# EAGLE design baby_monitor_v2 (EAGLE 9.6.2)
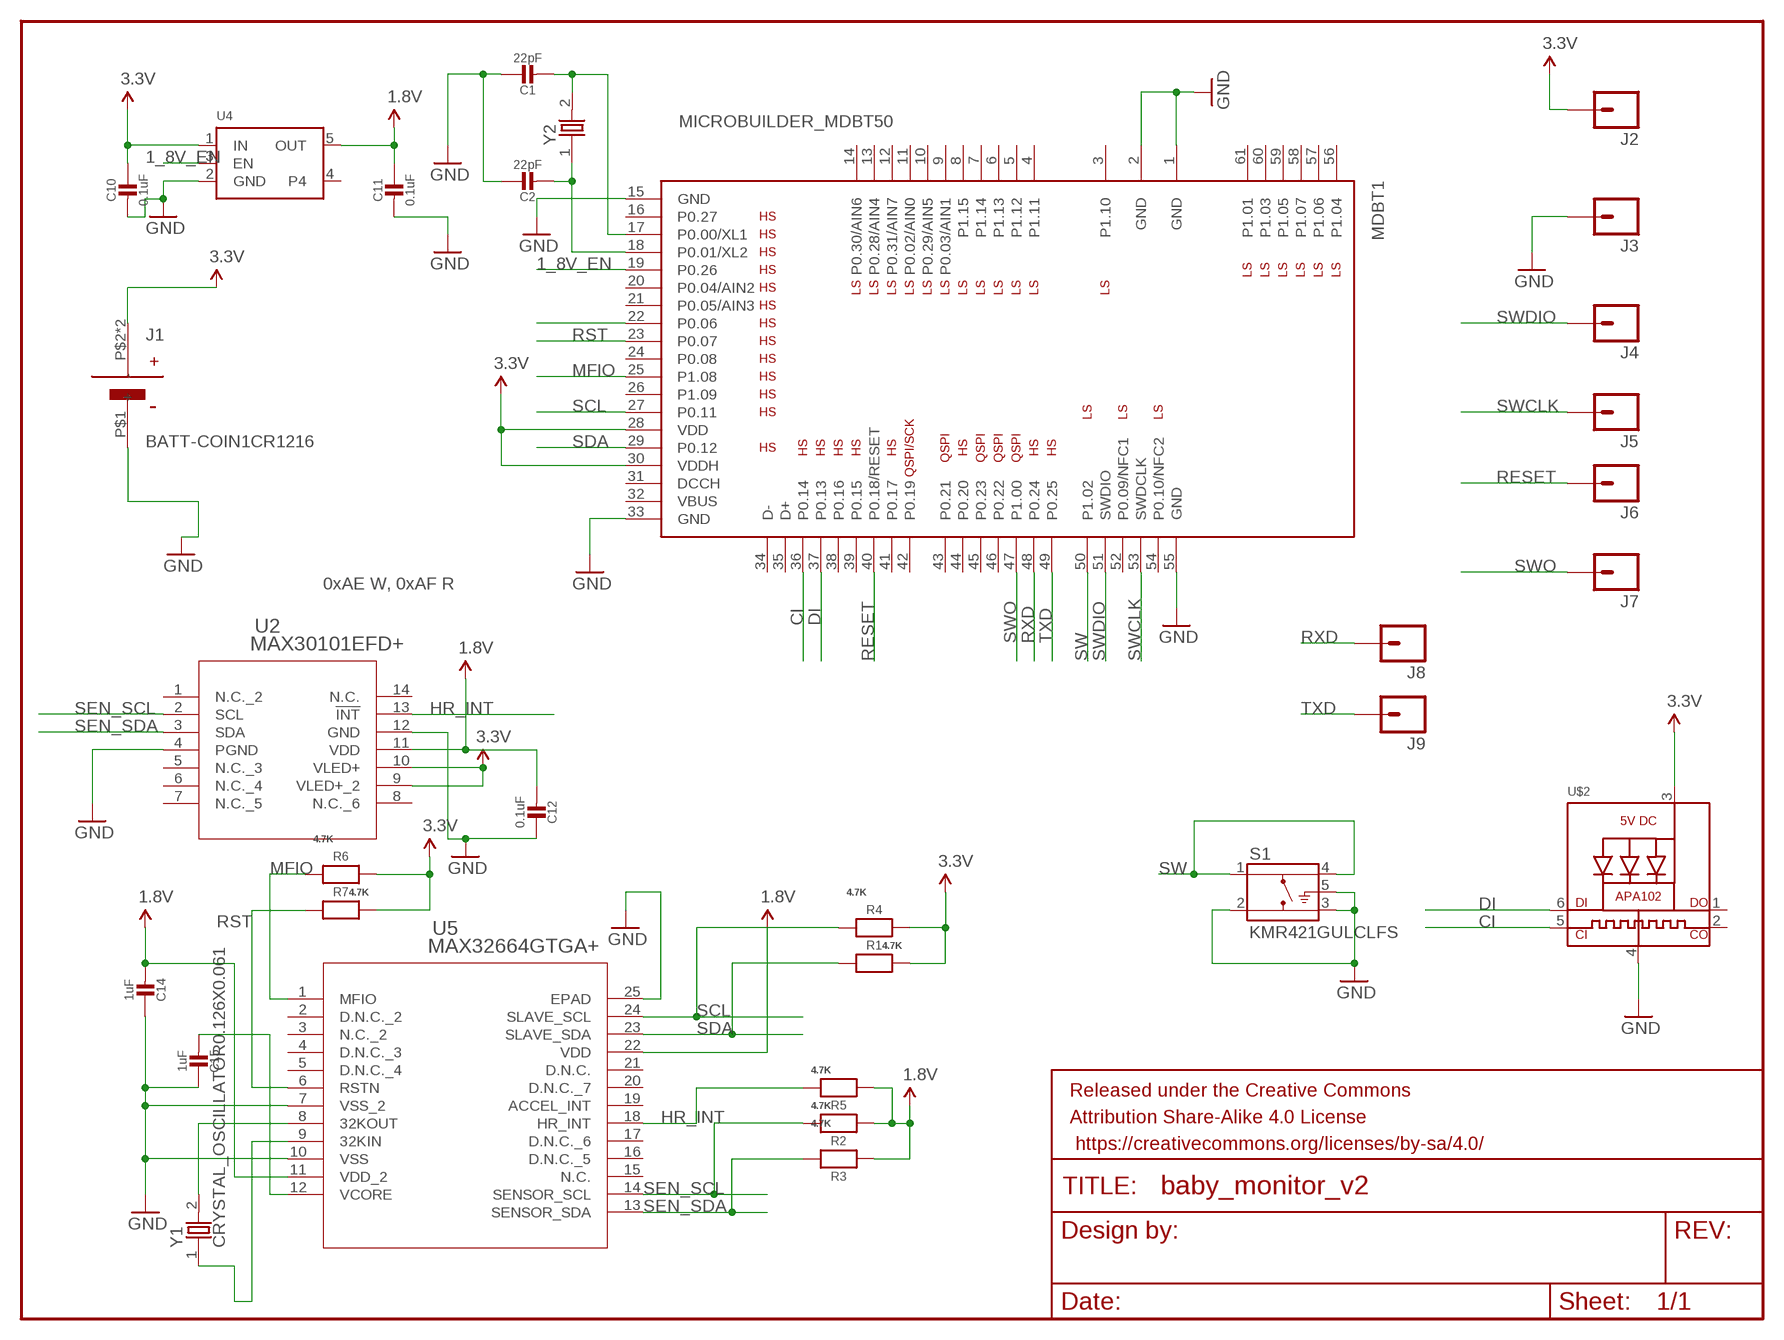
[diagram p0: schematic, sheet 1]

## Parts
C1  22pF  MICROBUILDER_CAP_CERAMIC_0402MP  [MICROBUILDER__0402MP]
C2  22pF  MICROBUILDER_CAP_CERAMIC_0402MP  [MICROBUILDER__0402MP]
C10  0.1uF  MICROBUILDER_CAP_CERAMIC_0402MP  [MICROBUILDER__0402MP]
C11  0.1uF  MICROBUILDER_CAP_CERAMIC_0402MP  [MICROBUILDER__0402MP]
C12  0.1uF  MICROBUILDER_CAP_CERAMIC_0402MP  [MICROBUILDER__0402MP]
C14  1uF  MICROBUILDER_CAP_CERAMIC_0402MP  [MICROBUILDER__0402MP]
C15  1uF  MICROBUILDER_CAP_CERAMIC_0402MP  [MICROBUILDER__0402MP]
FRAME2  FRAME-LETTERNO_PACKAGE  [DUMMY]
J1  BATT-COIN1CR1216  [BC-2017-TR]
J2  M01TINY  [1X01_TINY]
J3  M01TINY  [1X01_TINY]
J4  M01TINY  [1X01_TINY]
J5  M01TINY  [1X01_TINY]
J6  M01TINY  [1X01_TINY]
J7  M01TINY  [1X01_TINY]
J8  M01TINY_SMD_EXT  [1X01_SMD_TINY_EXT]
J9  M01TINY_SMD_EXT  [1X01_SMD_TINY_EXT]
MDBT1  MICROBUILDER_MDBT50  [MICROBUILDER_MDBT50]
R1  4.7K  MICROBUILDER_RESISTOR_0402MP  [MICROBUILDER__0402MP]
R2  4.7K  MICROBUILDER_RESISTOR_0402MP  [MICROBUILDER__0402MP]
R3  4.7K  MICROBUILDER_RESISTOR_0402MP  [MICROBUILDER__0402MP]
R4  4.7K  MICROBUILDER_RESISTOR_0402MP  [MICROBUILDER__0402MP]
R5  4.7K  MICROBUILDER_RESISTOR_0402MP  [MICROBUILDER__0402MP]
R6  4.7K  MICROBUILDER_RESISTOR_0402MP  [MICROBUILDER__0402MP]
R7  4.7K  MICROBUILDER_RESISTOR_0402MP  [MICROBUILDER__0402MP]
S1  KMR421GULCLFS  [SW_KMR421GULCLFS]
U2  MAX30101EFD+  [21-0880B_MXM]
U4  MICROBUILDER_VREG_SOT23-5  [MICROBUILDER_SOT23-5]
U5  MAX32664GTGA+  [21-100264_90-100089_MXM]
U$2  MICROBUILDER_APA1022020  [MICROBUILDER_APA102_2020]
Y1  CRYSTAL_OSCILLATOR0.126X0.061  [QUARTZ]
Y2  CRYSTAL_OSCILLATOR0.126X0.061  [QUARTZ]

## Nets
1.8V: C11.1 C12.2 C14.2 R2.1 R3.1 R5.1 U2.11(VDD) U4.5(OUT) U5.11(VDD_2) U5.22(VDD)
1_8V_EN: MDBT1.19(P0.26) U4.3(EN)
3.3V: C10.1 J1.P$2(+) J1.P$3(+) J2.P$1 MDBT1.28(VDD) MDBT1.30(VDDH) R1.2 R4.2 R6.2 R7.2 U2.9(VLED+_2) U2.10(VLED+) U4.1(IN) U$2.3(VDD)
CI: MDBT1.36(P0.14) U$2.5(CKI)
DI: MDBT1.37(P0.13) U$2.6(DI)
GND: C1.1 C2.1 C10.2 C11.2 C12.1 C14.1 C15.1 J1.P$1(-) J3.P$1 MDBT1.1(GND) MDBT1.2(GND) MDBT1.15(GND) MDBT1.33(GND) MDBT1.55(GND) S1.2 S1.3 S1.5(G) U2.4(PGND) U2.12(GND) U4.2(GND) U5.7(VSS_2) U5.10(VSS) U5.25(EPAD) U$2.4(GND)
HR_INT: R5.2 U2.13(!INT) U5.18(HR_INT)
MFIO: MDBT1.25(P1.08) R6.1 U5.1(MFIO)
N$1: C1.2 MDBT1.17(P0.00/XL1) Y2.2
N$2: MDBT1.22(P0.06)
N$3: C2.2 MDBT1.18(P0.01/XL2) Y2.1
N$14: C15.2 U5.12(VCORE)
N$15: U5.8(32KOUT) Y1.2
N$16: U5.9(32KIN) Y1.1
RESET: J6.P$1 MDBT1.40(P0.18/RESET)
RST: MDBT1.23(P0.07) R7.1 U5.6(RSTN)
RXD: J8.P$1 MDBT1.48(P0.24)
SCL: MDBT1.27(P0.11) R4.1 U5.24(SLAVE_SCL)
SDA: MDBT1.29(P0.12) R1.1 U5.23(SLAVE_SDA)
SEN_SCL: R2.2 U2.2(SCL) U5.14(SENSOR_SCL)
SEN_SDA: R3.2 U2.3(SDA) U5.13(SENSOR_SDA)
SW: MDBT1.50(P1.02) S1.1 S1.4
SWCLK: J5.P$1 MDBT1.53(SWDCLK)
SWDIO: J4.P$1 MDBT1.51(SWDIO)
SWO: J7.P$1 MDBT1.47(P1.00)
TXD: J9.P$1 MDBT1.49(P0.25)
Unconnected: MDBT1.3(P1.10) MDBT1.4(P1.11) MDBT1.5(P1.12) MDBT1.6(P1.13) MDBT1.7(P1.14) MDBT1.8(P1.15) MDBT1.9(P0.03/AIN1) MDBT1.10(P0.29/AIN5) MDBT1.11(P0.02/AIN0) MDBT1.12(P0.31/AIN7) MDBT1.13(P0.28/AIN4) MDBT1.14(P0.30/AIN6) MDBT1.16(P0.27) MDBT1.20(P0.04/AIN2) MDBT1.21(P0.05/AIN3) MDBT1.24(P0.08) MDBT1.26(P1.09) MDBT1.31(DCCH) MDBT1.32(VBUS) MDBT1.34(D-) MDBT1.35(D+) MDBT1.38(P0.16) MDBT1.39(P0.15) MDBT1.41(P0.17) MDBT1.42(P0.19) MDBT1.43(P0.21) MDBT1.44(P0.20) MDBT1.45(P0.23) MDBT1.46(P0.22) MDBT1.52(P0.09/NFC1) MDBT1.54(P0.10/NFC2) MDBT1.56(P1.04) MDBT1.57(P1.06) MDBT1.58(P1.07) MDBT1.59(P1.05) MDBT1.60(P1.03) MDBT1.61(P1.01) U2.1(N.C._2) U2.5(N.C._3) U2.6(N.C._4) U2.7(N.C._5) U2.8(N.C._6) U2.14(N.C.) U4.4 U5.2(D.N.C._2) U5.3(N.C._2) U5.4(D.N.C._3) U5.5(D.N.C._4) U5.15(N.C.) U5.16(D.N.C._5) U5.17(D.N.C._6) U5.19(ACCEL_INT) U5.20(D.N.C._7) U5.21(D.N.C.) U$2.1(DO) U$2.2(CKO)

## Notes on the sheet
- 0xAE W, 0xAF R

## Library data of the parts
C1 C2 C10-C12 C14 C15 = Adafruit Circuit Playground Bluefruit:MICROBUILDER_CAP_CERAMIC: Ceramic Capacitors For new designs, use the packages preceded by an '_' character since they are more reliable: The following footprints should be used on most boards: _0402 - Standard footprint for regular board layouts _0603 - Standard footprint for regular board layouts _0805 - Standard footprint for regular board layouts _1206 - Standard footprint for regular board layouts For extremely tight-pitch boards where space is at a premium, the following 'micro-pitch' footprints can be used (smaller pads, no silkscreen outline, etc.): _0402MP - Micro-pitch footprint for very dense/compact boards _0603MP - Micro-pitch footprint for very dense/compact boards _0805MP - Micro-pitch footprint for very dense/compact boards _1206MP - Micro-pitch footprint for very dense/compact boards
FRAME2 = SparkFun-Aesthetics:FRAME-LETTER: Schematic Frame Standard 8.5x11 US Letter frame; DESIGNER: Nobody; VERSION: v01
J1 = graftel-internal-ic:BATT-COIN1: Digikey Part Number: BLP2032SM-GCT-ND link:https://www.digikey.com/product-detail/en/mpd-memory-protection-devices/BLP2032SM-GTR/BLP2032SM-GCT-ND/3628537
J2-J9 = graftel-internal-ic:M01: Header 1 Standard 1-pin 0.1" header. Use with straight break away headers (SKU : PRT-00116), right angle break away headers (PRT-00553), swiss pins (PRT-00743), machine pins (PRT-00117), and female headers (PRT-00115). SMTSO-256-ET is a "flush mount" nut for a 4-40 screw. The older package used to be too tight, and did not allow it to sit properly thru the drill hit. The latest (0.165DIA) fits nice and snug.
MDBT1 = graftel-internal-ic:MICROBUILDER_MDBT50: Raytac Corporation MDBT50 Bluetooth Low Energy Module based on Noridc nRF52840 Source: Raytac datasheet
R1-R7 = Adafruit Circuit Playground Bluefruit:MICROBUILDER_RESISTOR: Resistors For new designs, use the packages preceded by an '_' character since they are more reliable: The following footprints should be used on most boards: _0402 - Standard footprint for regular board layouts _0603 - Standard footprint for regular board layouts _0805 - Standard footprint for regular board layouts _1206 - Standard footprint for regular board layouts For extremely tight-pitch boards where space is at a premium, the following 'micro-pitch' footprints can be used (smaller pads, no silkscreen outline, etc.): _0402MP - Micro-pitch footprint for very dense/compact boards _0603MP - Micro-pitch footprint for very dense/compact boards _0805MP - Micro-pitch footprint for very dense/compact boards _1206MP - Micro-pitch footprint for very dense/compact boards
S1 = graftel-internal-ic:KMR421GULCLFS: Switch Tactile N.O. SPST Round Button Gull Wing 0.05A 32VDC 1VA 200000Cycles 2N SMD Automotive T/R; DESCRIPTION: Tactile Switch SPST-NO Top Actuated Surface Mount; DIGI-KEY_PART_NUMBER: CKN12152CT-ND; MF: C&K; MP: KMR421GULCLFS; PACKAGE: None; PURCHASE-URL: https://pricing.snapeda.com/search/part/KMR421GULCLFS/?ref=eda
U2 = graftel-internal-ic:MAX30101EFD+; BUILT_BY: EMA_UL_Team; MANUFACTURER_PART_NUMBER: MAX30101EFD+; SOURCELIBRARY: Update_to_database_2021-01-13; VENDOR: Maxim Integrated Products
U4 = Adafruit Circuit Playground Bluefruit:MICROBUILDER_VREG_SOT23-5: SOT23-5 Fixed Voltage Regulators Part Current Out V Out V In V Dropout θJA (°C/W) TJ (°C) Digikey Part No. ADP121 150mA 3.3V 3.4-5.5V 0.09V @ 150mA -- -- ADP121-AUJZ33R7CT-ND ADP121 150mA 3.0V 3.1-5.5V 0.09V @ 150mA -- -- ADP121-AUJZ30R7CT-ND ADP122 300mA 3.3V 3.4-5.5V 0.085V @ 300mA -- -- ADP122AUJZ-3.3-R7CT-ND ADP1712 300mA 3.3V 3.5-5.5V 0.17V @ 300mA -- -- ADP1712AUJZ-3.3-R7TR-ND AP7311 (Low Cost) 150mA 3.3V 3.5-6V 0.15V @ 150mA -- -- AP7311-33WG-7DICT-ND LD39015M18R 150mA 1.8V 1.9V-5.5V 0.08V @ 100mA -- -- 497-6977-1-ND LP2985A-33DBVR 150mA 3.3V 3.3-16V 0.28V @ 150mA 206 150 296-18479-1-ND MCP1824T-3302E/OT 300mA 3.3V 3.5V-6V 0.2V @ 300mA -- -- MCP1824T-3302E/OTCT-ND MIC5205-2.5YM5 TR 150mA 2.5V 2.7-16V 0.165V @ 150mA -- -- 576-1257-2-ND MIC5205-3.0YM5 TR 150mA 3.0V 3.2V-16V 0.165V @ 150mA -- -- 576-1258-2-ND MIC5205-3.3YM5 TR 150mA 3.3V 3.5V-16V 0.165V @ 150mA -- -- 576-1259-2-ND TPS780330220 150mA 3.3V+2.2V 3.6-5.5V 250mV Max -- -- 296-23332-1-ND TDA3663/N1,135 100mA 3.3V 3.5-45V 0.18V @ 50mA -- -- 568-5343-1-ND Max operating temp can be calculated using θJA, TJ (max junction temperature), and power in watts. Set the "Maximum Ambient Temperature" until it reaches TJ ("Max Junction Temperature"), which is the absolute limit for safe use of the regulator: Heat Sink Temperature Calculator <http://www.daycounter.com/Calculators/Heat-Sink-Temperature-Calculator.phtml> For example, With 12V source into a 3.3V LP2985 and a 30mA load, we are dissipating (12V-3.3V) * 0.03A = 0.261W. With a θJA of 206 °C/W, a TJ of 150°C, and 261mW we can safely use the chip without a heat sink up to 75°C (=147.1°C Junction Temperature).
U5 = graftel-internal-ic:MAX32664GTGA+; BUILT_BY: EMA_Rebekah; COPYRIGHT: Copyright (C) 2018 Accelerated Designs. All rights reserved; MANUFACTURER_PART_NUMBER: MAX32664GTGA+; REVISION: 2; SOURCELIBRARY: Maxim_2020-02-10; VENDOR: Maxim Integrated Products
U$2 = graftel-internal-ic:MICROBUILDER_APA102: APA102/DotStar Pixels VCC: 5V DC Refresh Rate: 400Hz
Y1 Y2 = graftel-internal-ic:CRYSTAL_OSCILLATOR: SER4072CT-ND; PARTNO: SER4072CT-ND

## Board
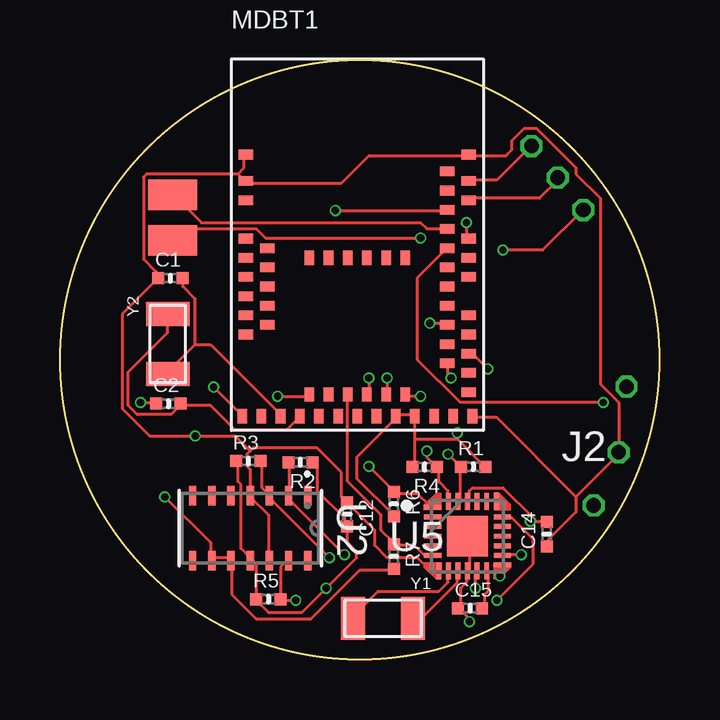
[diagram p1: board, top side]
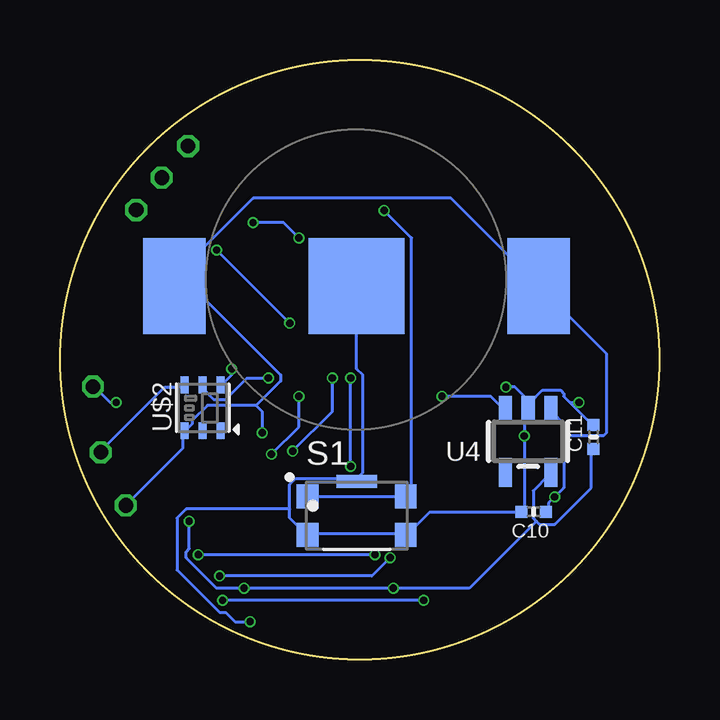
[diagram p2: board, bottom side, seen from below]

Size 25 x 25 mm. Coordinates in mm from the lower left corner, seen from the top.
Outline: circle at 12.5,12.5 radius 12.5
Copper layers (1*16): Top 0.035559375mm / dielectric 1.6mm / Bottom 0.035559375mm
Design rules "jlcpcb2layer": minimum track width 5mil, minimum drill 12mil, track to track 5mil, track to pad 5mil, pad to pad 5mil, via to via 5mil, smd to smd 5mil, copper to edge 8mil, drill to drill 6mil, minimum pad ring 5mil, minimum via ring 3mil, stop-mask expansion 2.5mil, vias tented up to drill 0mil, thermal gap 10mil

### Footprints (pad centres in the part's own frame; a part is rotated, then mirrored left to right if it is on the bottom)
MICROBUILDER__0402MP = smd 0.5 x 0.5: 1 -0.508,0; 2 0.508,0
BC-2017-TR = smd 4 x 4: P$1 0,0 | smd 2.6 x 4: P$2 -7.59,0; P$3 7.59,0
1X01_TINY = drill 0.61 octagon: P$1 0,0
1X01_SMD_TINY_EXT = smd 1.27 x 2.032: P$1 0,0
MICROBUILDER_MDBT50 = smd 0.6 x 0.4: 1 -4.65,3.75; 2 -4.65,2.65; 3 -4.65,1.85; 4 -4.65,0.25; 5 -3.75,-0.15; 6 -4.65,-0.55; 7 -3.75,-0.95; 8 -4.65,-1.35; 9 -3.75,-1.75; 10 -4.65,-2.15; 11 -3.75,-2.55; 12 -4.65,-2.95; 13 -3.75,-3.35; 14 -4.65,-3.75; 34 4.65,-6.15; 35 4.65,-5.35; 36 3.75,-4.95; 37 4.65,-4.55; 38 3.75,-4.15; 39 4.65,-3.75; 40 3.75,-3.35; 41 4.65,-2.95; 42 3.75,-2.55; 43 3.75,-1.75; 44 4.65,-1.35; 45 3.75,-0.95; 46 4.65,-0.55; 47 3.75,-0.15; 48 4.65,0.25; 49 3.75,0.65; 50 3.75,1.45; 51 4.65,1.85; 52 3.75,2.25; 53 4.65,2.65; 54 3.75,3.05; 55 4.65,3.75 | smd 0.4 x 0.6: 15 -4.8,-7.15; 16 -4,-7.15; 17 -3.2,-7.15; 18 -2.4,-7.15; 19 -2,-6.25; 20 -1.6,-7.15; 21 -1.2,-6.25; 22 -0.8,-7.15; 23 -0.4,-6.25; 24 0,-7.15; 25 0.4,-6.25; 26 0.8,-7.15; 27 1.2,-6.25; 28 1.6,-7.15; 29 2,-6.25; 30 2.4,-7.15; 31 3.2,-7.15; 32 4,-7.15; 33 4.8,-7.15; 56 -2,-0.55; 57 -1.2,-0.55; 58 -0.4,-0.55; 59 0.4,-0.55; 60 1.2,-0.55; 61 2,-0.55
SW_KMR421GULCLFS = smd 0.9 x 1: 1 -2.05,0.8; 2 -2.05,-0.8; 3 2.05,-0.8; 4 2.05,0.8 | smd 1.7 x 0.55: 5 0,1.425
21-0880B_MXM = smd 0.813 x 0.305: 1 -1.346,2.4; 2 -1.346,1.6; 3 -1.346,0.8; 4 -1.346,0; 5 -1.346,-0.8; 6 -1.346,-1.6; 7 -1.346,-2.4; 8 1.346,-2.4; 9 1.346,-1.6; 10 1.346,-0.8; 11 1.346,0; 12 1.346,0.8; 13 1.346,1.6; 14 1.346,2.4
MICROBUILDER_SOT23-5 = smd 0.55 x 1.2: 1 -0.95,-1.3; 2 0,-1.3; 3 0.95,-1.3; 4 0.95,1.3; 5 -0.95,1.3
21-100264_90-100089_MXM = smd 0.711 x 0.203: 1 -1.45,1.2; 2 -1.45,0.8; 3 -1.45,0.4; 4 -1.45,0; 5 -1.45,-0.4; 6 -1.45,-0.8; 13 1.45,-1.2; 14 1.45,-0.8; 15 1.45,-0.4; 16 1.45,0; 17 1.45,0.4; 18 1.45,0.8 | smd 0.203 x 0.711: 7 -1.2,-1.45; 8 -0.8,-1.45; 9 -0.4,-1.45; 10 0,-1.45; 11 0.4,-1.45; 12 0.8,-1.45; 19 1.2,1.45; 20 0.8,1.45; 21 0.4,1.45; 22 0,1.45; 23 -0.4,1.45; 24 -0.8,1.45 | smd 1.702 x 1.702: 25 0,0
MICROBUILDER_APA102_2020 = smd 0.7 x 0.35: 1 -0.95,-0.75; 2 -0.95,0; 3 -0.95,0.75; 4 0.95,0.75; 5 0.95,0; 6 0.95,-0.75
QUARTZ = smd 1 x 1.8: 1 -1.25,0; 2 1.25,0

### Placement (x,y rotation side)
C1  4.6,15.9 0 top
C2  4.52,10.67 0 top
C10  5.25,6.16 180 bottom
C11  2.76,9.28 90 bottom
C12  11.97,6.05 270 top
C14  20.3,5.24 90 top
C15  17.09,2.14 0 top
FRAME2  5.64,-20.27 0 top  (outside the outline)
J1  12.64,15.57 0 bottom
J2  22.25,6.43 0 top
J3  23.3,8.64 0 top
J4  20.75,20.09 0 top
J5  19.66,21.42 0 top
J6  21.82,18.75 0 top
J7  23.63,11.38 0 top
J8  4.7,17.48 90 top
J9  4.7,19.38 90 top
MDBT1  12.4,17.3 0 top
R1  17.23,8.04 0 top
R2  10.03,8.23 180 top
R3  7.85,8.28 0 top
R4  15.2,8.03 180 top
R5  8.69,2.52 0 top
R6  13.92,6.48 270 top
R7  13.92,4.3 270 top
S1  12.63,6 0 bottom
U2  7.93,5.48 270 top
U4  5.48,9.1 180 bottom
U5  16.99,5.15 0 top
U$2  19.05,10.49 90 bottom
Y1  13.47,1.72 180 top
Y2  4.5,13.16 270 top

### Tracks (layer width: path | path; a pad name or v marks a point on that pad's centre or on a via)
1.8V  (via drill 0.3)
  Top 0.127: R2.1 10.6,8.18 10.72,8.05 10.72,7.04 11.87,5.9 11.87,5.64 C12.2 11.99,5.52 11.99,4.88 12.37,4.5 12.37,4.25 v11.1,2.98 10.09,1.96 8.69,1.96 8.18,2.47 R5.1 8.18,3.99 8.05,4.12 U2.11 7.93,4.25 7.55,4.63 7.55,7.29 7.42,7.42 7.42,8.18 R3.1 | 19.74,5.9 18.47,7.17 17.2,7.17 17.07,7.04 17.07,6.66 U5.22 | 19.74,5.9 19.87,5.77 20.25,5.77 C14.2 | v17.33,2.98 17.33,3.61 U5.11 | v19.61,5.77 19.74,5.9
  Bottom 0.127: 5.13,5.77 5.26,5.9 5.26,7.04 4.63,7.67 U4.5 | 5.13,5.77 5.01,5.64 4.37,5.64 2.85,7.17 2.85,8.69 C11.1 | 5.13,5.77 7.93,2.98 v11.1,2.98 v17.33,2.98 18.47,2.98 19.74,4.25 19.74,4.5 19.61,4.63 v19.61,5.77
1_8V_EN  (via drill 0.3)
  Top 0.127: v9.07,10.98 10.34,10.98 MDBT1.19
  Bottom 0.127: v9.07,10.98 7.04,10.98 6.53,10.47 U4.3
3.3V  (via drill 0.3)
  Top 0.127: 14.79,9.2 14.79,10.09 MDBT1.30 14.79,10.21 14.02,10.21 MDBT1.28 14.02,10.09 12.37,8.44 12.37,7.55 13.9,6.02 R6.2 | 14.79,9.2 14.79,8.05 R4.2 | 16.56,9.2 17.71,8.05 R1.2 | 14.79,9.2 16.56,9.2 | v16.56,9.45 16.56,9.2 | R7.2 13.9,3.74 12.5,3.74 10.47,1.71 8.18,1.71 7.17,2.72 7.17,4.12 U2.10 7.04,4.25 6.4,4.25 U2.9 6.28,4.25 6.28,4.88 v4.37,6.79
  Bottom 0.127: J2.P$1 19.87,8.82 19.87,9.45 U$2.3 19.74,9.58 19.48,9.83 19.48,9.96 18.85,10.6 16.82,10.6 | 16.82,10.6 15.8,11.61 15.8,11.87 19.48,15.55 | 19.48,15.55 20.12,15.55 J1.P$2 19.48,15.55 | v16.56,9.45 16.56,10.34 16.82,10.6 | 3.99,9.32 3.99,9.83 4.5,10.34 U4.1 | 3.99,9.32 3.99,7.17 v4.37,6.79 4.63,6.53 4.63,6.28 C10.1 | 3.99,9.32 2.34,9.32 2.21,9.45 2.21,12.75 5.01,15.55 J1.P$3 5.13,15.68 8.69,19.23 16.95,19.23 19.48,16.69 19.48,15.55
CI  (via drill 0.3)
  Top 0.127: v16.31,11.74 16.18,11.87 16.18,12.25 MDBT1.36
  Bottom 0.127: v16.31,11.74 17.2,11.74 18.09,10.85 18.6,10.85 19.1,11.36 U$2.5
DI  (via drill 0.3)
  Top 0.127: v17.83,12.12 17.33,12.63 17.07,12.63 MDBT1.37
  Bottom 0.127: v17.83,12.12 17.83,11.87 18.21,11.48 U$2.6
GND  (via drill 0.3)
  Top 0.127: v3.36,10.72 3.99,10.72 C2.1 | v6.4,11.36 7.55,10.21 MDBT1.15 | U5.25 17.07,5.13 17.07,3.74 U5.10 16.95,3.61 16.95,3.23 16.69,2.98 16.69,2.21 C15.1 16.69,2.09 17.07,1.71 v17.07,1.58 | 21.52,6.79 21.52,6.15 20.37,5.01 20.37,4.75 C14.1 | 21.52,6.79 23.3,8.56 J3.P$1 23.3,10.72 22.53,11.48 22.53,19.23 21.52,20.25 21.52,20.5 19.87,22.15 19.36,22.15 18.85,21.64 18.85,21.26 18.6,21.01 17.07,21.01 MDBT1.55 16.95,21.01 12.88,21.01 11.74,19.87 7.8,19.87 MDBT1.2 7.67,19.99 7.42,20.25 | 21.52,6.79 18.21,10.09 17.2,10.09 MDBT1.33 | U2.12 8.69,4.25 8.69,6.02 7.93,6.79 U2.4 7.93,6.91 7.93,7.93 7.8,8.05 7.8,8.56 7.93,8.69 | U5.7 15.8,3.74 15.42,3.74 14.91,4.25 13.64,4.25 13.14,4.75 13.14,5.39 11.99,6.53 C12.1 11.87,6.66 11.74,6.79 11.74,7.8 10.72,8.82 8.05,8.82 7.93,8.69 | 7.42,20.25 3.61,20.25 3.48,20.12 3.48,16.69 3.99,16.18 3.99,15.93 C1.1 2.59,14.41 2.59,10.47 3.74,9.32 v5.64,9.32 7.29,9.32 7.93,8.69 | 7.42,20.25 7.67,20.5 7.67,21.01 MDBT1.1
  Bottom 0.127: 3.74,10.72 3.99,10.98 3.99,11.1 4.12,11.23 4.88,11.23 5.39,10.72 | 3.74,10.72 2.85,9.83 C11.2 | 5.39,10.72 5.39,10.47 U4.2 | 3.74,10.72 v3.36,10.72 | U4.2 5.52,10.34 5.64,10.21 v5.64,9.32 5.64,6.28 C10.2 5.77,6.15 9.58,6.15 10.47,5.26 S1.3 10.6,5.26 14.66,5.26 S1.2 14.79,5.26 15.42,5.9 15.42,6.28 | v6.4,11.36 6.02,11.36 5.39,10.72 | 5.39,10.72 U4.2 | 12.63,7.55 15.17,7.55 15.42,7.29 15.42,6.28 | v17.07,1.58 17.71,1.58 18.09,1.96 18.34,1.96 20.12,3.74 20.12,5.9 19.74,6.28 15.42,6.28 | 12.63,7.55 12.37,7.8 12.37,11.87 12.63,12.12 12.63,15.55 J1.P$1 | 12.63,7.55 S1.5 | U$2.4 19.87,11.36 20.63,11.36 23.3,8.69 J3.P$1
HR_INT  (via drill 0.3)
  Top 0.127: U2.13 9.45,4.12 9.2,3.86 R5.2 9.2,2.47 v9.83,2.47 | v18.21,2.47 19.74,3.99 19.74,5.01 18.85,5.9 18.47,5.9 U5.18
  Bottom 0.127: v9.83,2.47 v18.21,2.47
MFIO  (via drill 0.3)
  Top 0.127: U5.1 15.42,6.4 14.91,6.91 14.02,6.91 R6.1 13.9,7.04 v12.88,8.05 | v12.88,11.74 12.88,11.1 MDBT1.25
  Bottom 0.127: v12.88,8.05 v12.88,11.74
N$1
  Top 0.127: 5.64,13.13 5.64,15.04 5.13,15.55 5.13,15.8 C1.2 | 5.64,13.13 4.5,11.99 Y2.2 | 5.64,13.13 6.28,13.13 9.2,10.21 MDBT1.17
N$3
  Top 0.127: MDBT1.18 9.96,10.09 9.45,9.58 7.29,9.58 6.28,10.6 5.13,10.6 C2.2 5.01,10.6 4.63,10.21 3.23,10.21 2.85,10.6 2.85,11.99 4.5,13.64 Y2.1
N$14
  Top 0.127: C15.2 17.71,2.21 17.71,2.72 17.83,2.85 17.83,3.61 U5.12
N$15
  Top 0.127: U5.8 16.18,3.61 16.18,3.23 15.8,2.85 13.26,2.85 12.25,1.83 Y1.2
N$16
  Top 0.127: U5.9 16.56,3.61 16.56,3.23 15.17,1.83 14.79,1.83 Y1.1
RESET  (via drill 0.3)
  Top 0.127: v15.42,14.02 16.06,14.02 MDBT1.40 | v18.47,17.07 20.12,17.07 21.77,18.72 J6.P$1
  Bottom 0.127: v18.47,17.07 v15.42,14.02
RST
  Top 0.127: U5.6 15.42,4.37 15.17,4.37 14.79,4.75 14.02,4.75 R7.1 13.9,4.88 13.39,5.39 13.39,6.02 11.99,7.42 11.99,10.98 MDBT1.23
RXD  (via drill 0.3)
  Top 0.127: v16.95,18.21 16.95,17.58 MDBT1.48 | v15.04,17.58 8.56,17.58 8.18,17.96 5.13,17.96 4.75,17.58 J8.P$1
  Bottom 0.127: v16.95,18.21 15.68,18.21 v15.04,17.58
SCL  (via drill 0.3)
  Top 0.127: U5.24 16.18,6.66 16.18,7.04 15.8,7.42 15.8,7.93 R4.1 15.68,8.05 15.29,8.44 v15.29,8.69 | v13.64,11.74 13.64,11.1 MDBT1.27
  Bottom 0.127: v13.64,11.74 13.64,10.34 v15.29,8.69
SDA  (via drill 0.3)
  Top 0.127: U5.23 16.69,6.66 16.69,7.93 R1.1 16.69,8.05 v16.18,8.56 | v15.04,10.98 14.41,10.98 MDBT1.29
  Bottom 0.127: v15.04,10.98 15.04,9.71 v16.18,8.56
SEN_SCL  (via drill 0.3)
  Top 0.127: R2.2 9.58,8.18 9.58,6.91 U2.2 9.45,6.79 v11.87,4.37 | v19.23,4.37 18.47,4.37 U5.14
  Bottom 0.127: v11.87,4.37 v19.23,4.37
SEN_SDA  (via drill 0.3)
  Top 0.127: R3.2 8.44,8.18 8.44,7.17 8.69,6.91 U2.3 8.69,6.79 v11.23,4.25 | v18.34,3.48 18.34,3.86 U5.13
  Bottom 0.127: v18.34,3.48 11.99,3.48 v11.23,4.25
SW  (via drill 0.3)
  Top 0.127: v11.48,18.72 16.06,18.72 MDBT1.50
  Bottom 0.127: v11.48,18.72 10.34,17.58 10.34,7.04 10.47,6.91 S1.4 10.6,6.79 14.66,6.79 S1.1
SWCLK
  Top 0.127: MDBT1.53 17.07,19.99 18.21,19.99 19.61,21.39 J5.P$1
SWDIO
  Top 0.127: MDBT1.51 17.07,19.23 19.99,19.23 20.75,19.99 J4.P$1
SWO  (via drill 0.3)
  Top 0.127: v22.66,10.72 16.69,10.72 14.91,12.5 14.91,15.93 16.06,17.07 MDBT1.47
  Bottom 0.127: v22.66,10.72 22.91,10.72 23.55,11.36 J7.P$1
TXD
  Top 0.127: MDBT1.49 16.06,17.96 15.29,17.96 15.04,18.21 5.9,18.21 4.75,19.36 J9.P$1